# EAGLE schematic resonate (EAGLE 6.5.0)
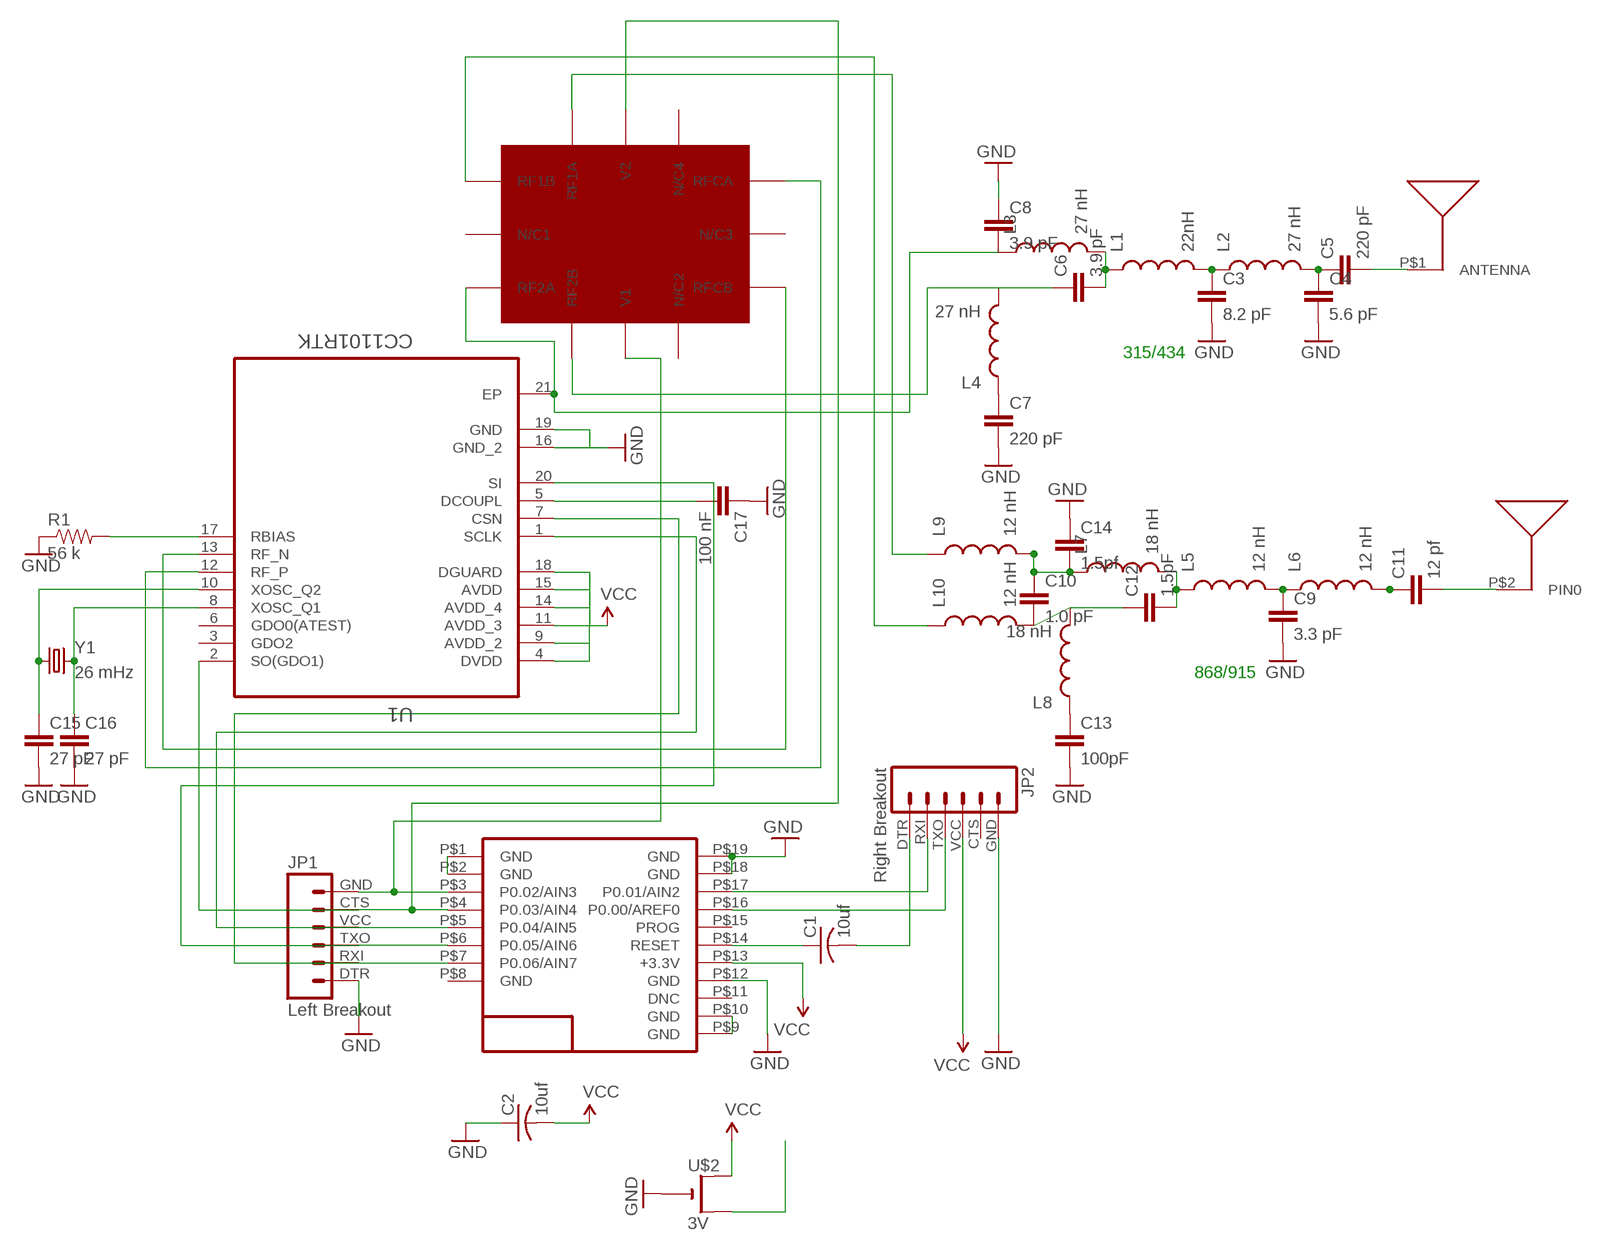
[diagram p0: schematic, sheet 1]

## Parts
C1  10uf  C-USC0603  [C0603]
C2  10uf  C-USC0603  [C0603]
C3  8.2 pF  CAP0402-CAP  [0402-CAP]
C4  5.6 pF  CAP0402-CAP  [0402-CAP]
C5  220 pF  CAP0402-CAP  [0402-CAP]
C6  3.9 pF  CAP0402-CAP  [0402-CAP]
C7  220 pF  CAP0402-CAP  [0402-CAP]
C8  3.9 pF  CAP0402-CAP  [0402-CAP]
C9  3.3 pF  CAP0402-CAP  [0402-CAP]
C10  1.0 pF  CAP0402-CAP  [0402-CAP]
C11  12 pf  CAP0402-CAP  [0402-CAP]
C12  1.5pF  CAP0402-CAP  [0402-CAP]
C13  100pF  CAP0402-CAP  [0402-CAP]
C14  1.5pf  CAP0402-CAP  [0402-CAP]
C15  27 pF  CAP0402-CAP  [0402-CAP]
C16  27 pF  CAP0402-CAP  [0402-CAP]
C17  100 nF  CAP0402-CAP  [0402-CAP]
JP1  Left Breakout  M06SIP  [1X06]
JP2  Right Breakout  M06SIP  [1X06]
L1  22nH  INDUCTOR0402  [C0402]
L2  27 nH  INDUCTOR0402  [C0402]
L3  27 nH  INDUCTOR0402  [C0402]
L4  27 nH  INDUCTOR0402  [C0402]
L5  12 nH  INDUCTOR0402  [C0402]
L6  12 nH  INDUCTOR0402  [C0402]
L7  18 nH  INDUCTOR0402  [C0402]
L8  18 nH  INDUCTOR0402  [C0402]
L9  12 nH  INDUCTOR0402  [C0402]
L10  12 nH  INDUCTOR0402  [C0402]
R1  56 k  RESISTOR0603-RES  [0603-RES]
U1  CC1101RTK  [QFN50P400X400X90-21N]
U$1  RFD22301  [RFD21733]
U$2  3V  CR2032THM  [CR2032-THRU]
U$3  ANT-868-JJB-ST  [ANT-868-JJB-ST]
U$5  SKY13354-368LF  [SKY13354-368LF]
U$6  ANT1204F002R0433A  [ANT1204F002R0433A]
Y1  26 mHz  CRYSTAL5X3  [CRYSTAL-SMD-5X3]

## Nets
GND: C2.1 C3.2 C4.2 C7.2 C8.1 C9.2 C13.2 C14.1 C15.2 C16.2 C17.1 JP1.DTR JP2.GND R1.1 U1.16(GND_2) U1.19(GND) U$1.P$12(GND) U$1.P$18(GND) U$1.P$19(GND) U$2.-
N$1: U$2.+2(+1)
N$4: U$1.P$9(GND) U$1.P$10(GND)
N$5: U$1.P$1(GND) U$1.P$2(GND)
N$6: C1.1 U$1.P$14(RESET)
N$7: C1.2 JP2.DTR
N$8: JP2.RXI U$1.P$17(P0.01/AIN2)
N$9: JP2.TXO U$1.P$16(P0.00/AREF0)
N$10: C3.1 L1.2 L2.1
N$11: C4.1 C5.1 L2.2
N$12: C6.1 L4.2 U$5.RF2B
N$13: C7.1 L4.1
N$14: C8.2 L3.1 U1.21(EP) U$5.RF2A
N$15: C9.1 L5.2 L6.1
N$16: C6.2 L1.1 L3.2
N$17: C11.1 L6.2
N$18: C10.2 C12.1 L8.2 L10.2
N$19: C13.1 L8.1
N$20: C10.1 C14.2 L7.1 L9.2
N$21: C12.2 L5.1 L7.2
N$22: C5.2 U$6.P$1(ANTENNA)
N$23: C11.2 U$3.P$2(PIN0)
N$24: U1.12(RF_P) U$5.RFCA
N$25: U1.13(RF_N) U$5.RFCB
N$26: C15.1 U1.10(XOSC_Q2) Y1.1
N$28: L9.1 U$5.RF1A
N$29: L10.1 U$5.RF1B
N$30: C16.1 U1.8(XOSC_Q1) Y1.3
N$31: R1.2 U1.17(RBIAS)
N$32: U1.20(SI)
N$34: C17.2 U1.5(DCOUPL)
P2: JP1.GND U$1.P$3(P0.02/AIN3) U$5.V1
P3: JP1.CTS U1.2(SO(GDO1)) U$1.P$4(P0.03/AIN4) U$5.V2
P4: JP1.VCC U1.1(SCLK) U$1.P$5(P0.04/AIN5)
P5: JP1.TXO U$1.P$6(P0.05/AIN6)
P6: JP1.RXI U1.7(CSN) U$1.P$7(P0.06/AIN7)
VCC: C2.2 JP2.VCC U1.4(DVDD) U1.9(AVDD_2) U1.11(AVDD_3) U1.14(AVDD_4) U1.15(AVDD) U1.18(DGUARD) U$1.P$13(+3.3V) U$2.+1(+)
Unconnected: JP2.CTS U1.3(GDO2) U1.6(GDO0(ATEST)) U$1.P$8(GND) U$1.P$11(DNC) U$1.P$15(PROG) U$5.N/C2 U$5.N/C3 U$5.N/C4 U$5.N/C(N/C1)

## Notes on the sheet
- 315/434
- 868/915

## Library data of the parts
C1 C2 = adafruit:C-US: CAPACITOR, American symbol
C3-C17 = SparkFun-Capacitors:CAP: Capacitor Standard 0603 ceramic capacitor, and 0.1" leaded capacitor.
JP1 JP2 = SparkFun-Connectors:M06: Header 6 Standard 6-pin 0.1" header. Use with straight break away headers (SKU : PRT-00116), right angle break away headers (PRT-00553), swiss pins (PRT-00743), machine pins (PRT-00117), and female headers (PRT-00115). Molex polarized connector foot print use with SKU : PRT-08094 with associated crimp pins and housings. NOTES ON THE VARIANTS LOCK and LOCK_LONGPADS... This footprint was designed to help hold the alignment of a through-hole component (i.e. 6-pin header) while soldering it into place. You may notice that each hole has been shifted either up or down by 0.005 of an inch from it's more standard position (which is a perfectly straight line). This slight alteration caused the pins (the squares in the middle) to touch the edges of the holes. Because they are alternating, it causes a "brace" to hold the component in place. 0.005 has proven to be the perfect amount of "off-center" position when using our standard breakaway headers. Although looks a little odd when you look at the bare footprint, once you have a header in there, the alteration is very hard to notice. Also,if you push a header all the way into place, it is covered up entirely on the bottom side. This idea of altering the position of holes to aid alignment will be further integrated into the Sparkfun Library for other footprints. It can help hold any component with 3 or more connection pins.
L1-L10 = SparkFun-Passives:INDUCTOR: Inductors Basic Inductor/Choke - 0603 and 1206. Footprints are not proven and vary greatly between part numbers. SRN6045- 33uH, 20% 1.4A SDR0403-560KL - 56uH, 10%, 500mA RMS/740mA peak
R1 = SparkFun-Passives:RESISTOR: Resistor Basic schematic elements and footprints for 0603, 1206, and PTH resistors.
U1 = Texas Instruments_By_element14_Batch_1:CC1101RTK: Low-Power Sub-1 GHz RF Transceiver; MPN: CC1101RTK; OC_FARNELL: 1555264; OC_NEWARK: 50M8833; PACKAGE: QFN-20; SUPPLIER: Texas Instruments
U$1 = RFD22301-11.25.13:RFD22301: RF Digital RFD22301
U$2 = adafruit:CR2032
U$3 = antenna:ANT-868-JJB-ST
U$5 = skyworks:SKY13354-368LF
U$6 = antenna:ANT1204F002R0433A
Y1 = SparkFun-FreqCtrl:CRYSTAL: Various standard crystals. Proven footprints. Spark Fun Electronics SKU : COM-00534